# Altium project PCB_Project.PrjPcb
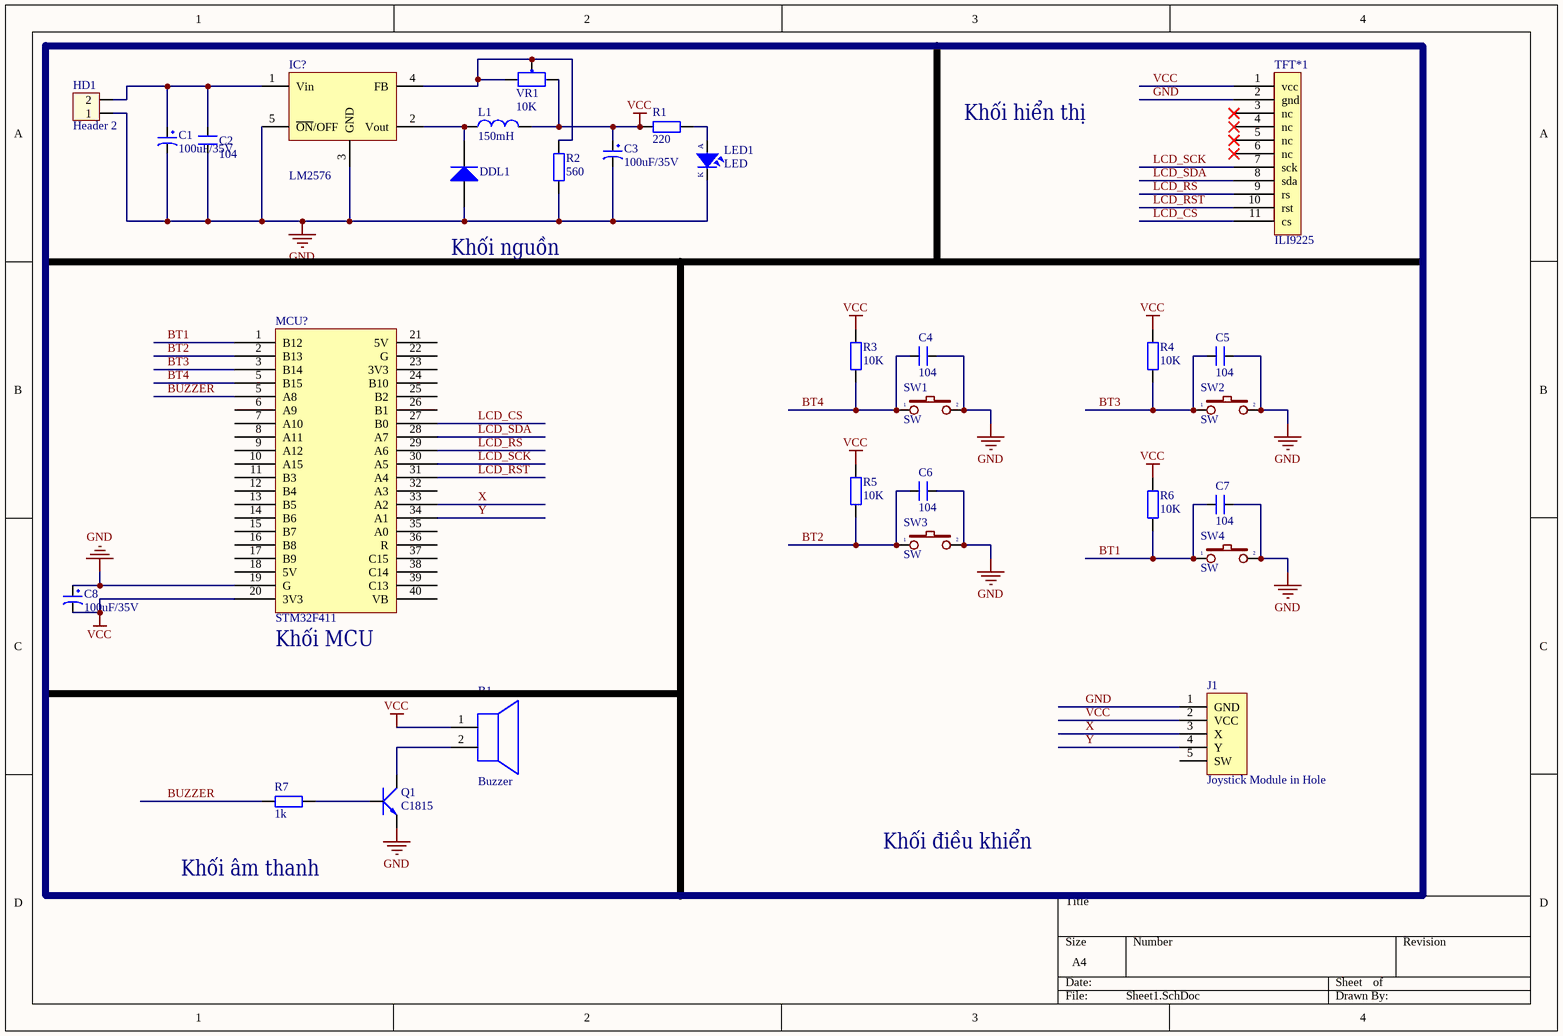
[diagram p0: Sheet1.SchDoc]
1 sheet, 30 parts. Net scope: global (net labels, ports and power ports of the same name join across sheets).
Board file: PCB1.PcbDoc

## Sheet Sheet1.SchDoc
size A4; SheetNumber: 1; SheetTotal: 1

### Parts
B1  Buzzer  [Buzzer]
C1  100uF/35V  [CP1.5/3.4]
C2  104  [CN2]
C3  100uF/35V  [CP1.5/3.4]
C4  104  [CN2]
C5  104  [CN2]
C6  104  [CN2]
C7  104  [CN2]
C8  100uF/35V  [CP1.5/3.4]
DDL1  Diode  [D5AN]  (value not drawn)
HD1  Header 2  [HED2]
IC?  LM2576  [QTO-220-5]
J1  Joystick Module in Hole  [JOYSTOCK_IN_HOLE]
L1  150mH  [L01]
LED1  LED  [LED-5]
MCU?  STM32F411  [DIP40]
Q1  C1815  [QTO-92]
R1  220  [R1/4W]
R2  560  [R1/2W]
R3  10K  [R1/4W]
R4  10K  [R1/4W]
R5  10K  [R1/4W]
R6  10K  [R1/4W]
R7  1k  [R1/4W]
SW1  SW  [SW2]
SW2  SW  [SW2]
SW3  SW  [SW2]
SW4  SW  [SW2]
TFT*1  ILI9225  [TFTILI]
VR1  10K  [VR-3296W]

### Nets
GND: C1.2 C2.2 C3.2 C4.1 C5.1 C6.1 C7.1 C8.1 DDL1.1(A) HD1.1 IC?.3(GND) IC?.5(~{ON}/OFF) J1.1(GND) LED1.2(K) MCU?.19(G) Q1.1(E) R2.1 SW1.2 SW2.2 SW3.2 SW4.2 TFT*1.2(gnd)
VCC: B1.1(+) C3.1 C8.2 J1.2(VCC) L1.2 MCU?.20(3V3) R1.2 R3.2 R4.2 R5.2 R6.2 TFT*1.1(vcc) VR1.3
BT1: C7.2 MCU?.1(B12) R6.1 SW4.1
BT2: C6.2 MCU?.2(B13) R5.1 SW3.1
BT3: C5.2 MCU?.3(B14) R4.1 SW2.1
BT4: C4.2 MCU?.5(B15) R3.1 SW1.1
BUZZER: MCU?.5(A8) R7.1
LCD_CS: MCU?.27(B0) TFT*1.11(cs)
LCD_RS: MCU?.29(A6) TFT*1.9(rs)
LCD_RST: MCU?.31(A4) TFT*1.10(rst)
LCD_SCK: MCU?.30(A5) TFT*1.7(sck)
LCD_SDA: MCU?.28(A7) TFT*1.8(sda)
X: J1.3(X) MCU?.33(A2)
Y: J1.4(Y) MCU?.34(A1)
NetB1_2: B1.2(-) Q1.2(C)
NetC1_1: C1.1 C2.1 HD1.2 IC?.1(Vin)
NetDDL1_2: DDL1.2(K) IC?.2(Vout) L1.1
NetIC?_4: IC?.4(FB) R2.2 VR1.1 VR1.2
NetLED1_1: LED1.1(A) R1.1
NetQ1_3: Q1.3(B) R7.2

Not connected (* = marked no-connect by the designer): J1 5(SW); MCU? 6(A9) 7(A10) 8(A11) 9(A12) 10(A15) 11(B3) 12(B4) 13(B5) 14(B6) 15(B7) 16(B8) 17(B9) 18(5V) 21(5V) 22(G) 23(3V3) 24(B10) 25(B2) 26(B1) 32(A3) 35(A0) 36(R) 37(C15) 38(C14) 39(C13) 40(VB); TFT*1 3(nc)* 4(nc)* 5(nc)* 6(nc)*

### Notes on the sheet
- Khối hiển thị
- Khối nguồn
- (near MCU?) Khối MCU
- Khối điều khiển
- Khối âm thanh

### Library data of the parts
C1 C3 C8 = CP3: Cap 100uF/35V - 470uF/16V; Value: 100uF/35V/50V; Description 1: 1000uF/6,3V - 470uF/16V - 330uF - 25V; Description 2: 220uF/35V - 100uF/50V - 63V - 4,7uF/200V; Description 3: 22uF => 33uF100V - 3,3uF => 4,7uF/250V; Description 4: 2,2uF =>3,3uF/350 - 2,2uF/400V - 1uF/450V
C2 C4-C7 = CN2: Cap np 104 => 105pF; Value: 0.1uF
DDL1 = Diode_1: Default Diode; Code - JEDEC: DO-214-AB; Value: 1N5007; Published: 8-Jun-2000; Revision: July-2002: Re-released for DXP Platform.; Publisher: Altium Limited
HD1 = Hed2: Header 2 (Green); Value: Header 2
J1 = Joystick Module in Hole: PartNumber: Arduino PS2 joystick Module
L1 = L1: Inductor; Value: 150 mH
LED1 = LED: LED Single colour Green and Red; Value: LED 3 ly Single Colour
Q1 = C1815: NPN 600mW, ECB; Value: C1815
R1-R7 = R1/4W: Resistor 1/4W; Value: R1/4W - 1K
SW1-SW4 = SW2: Switch button 2 pin; Value: SW chip 2 pin
VR1 = VR: Var Resistor; Value: VR 10K